# Altium schematic sheet mother_board.SchDoc
size A2
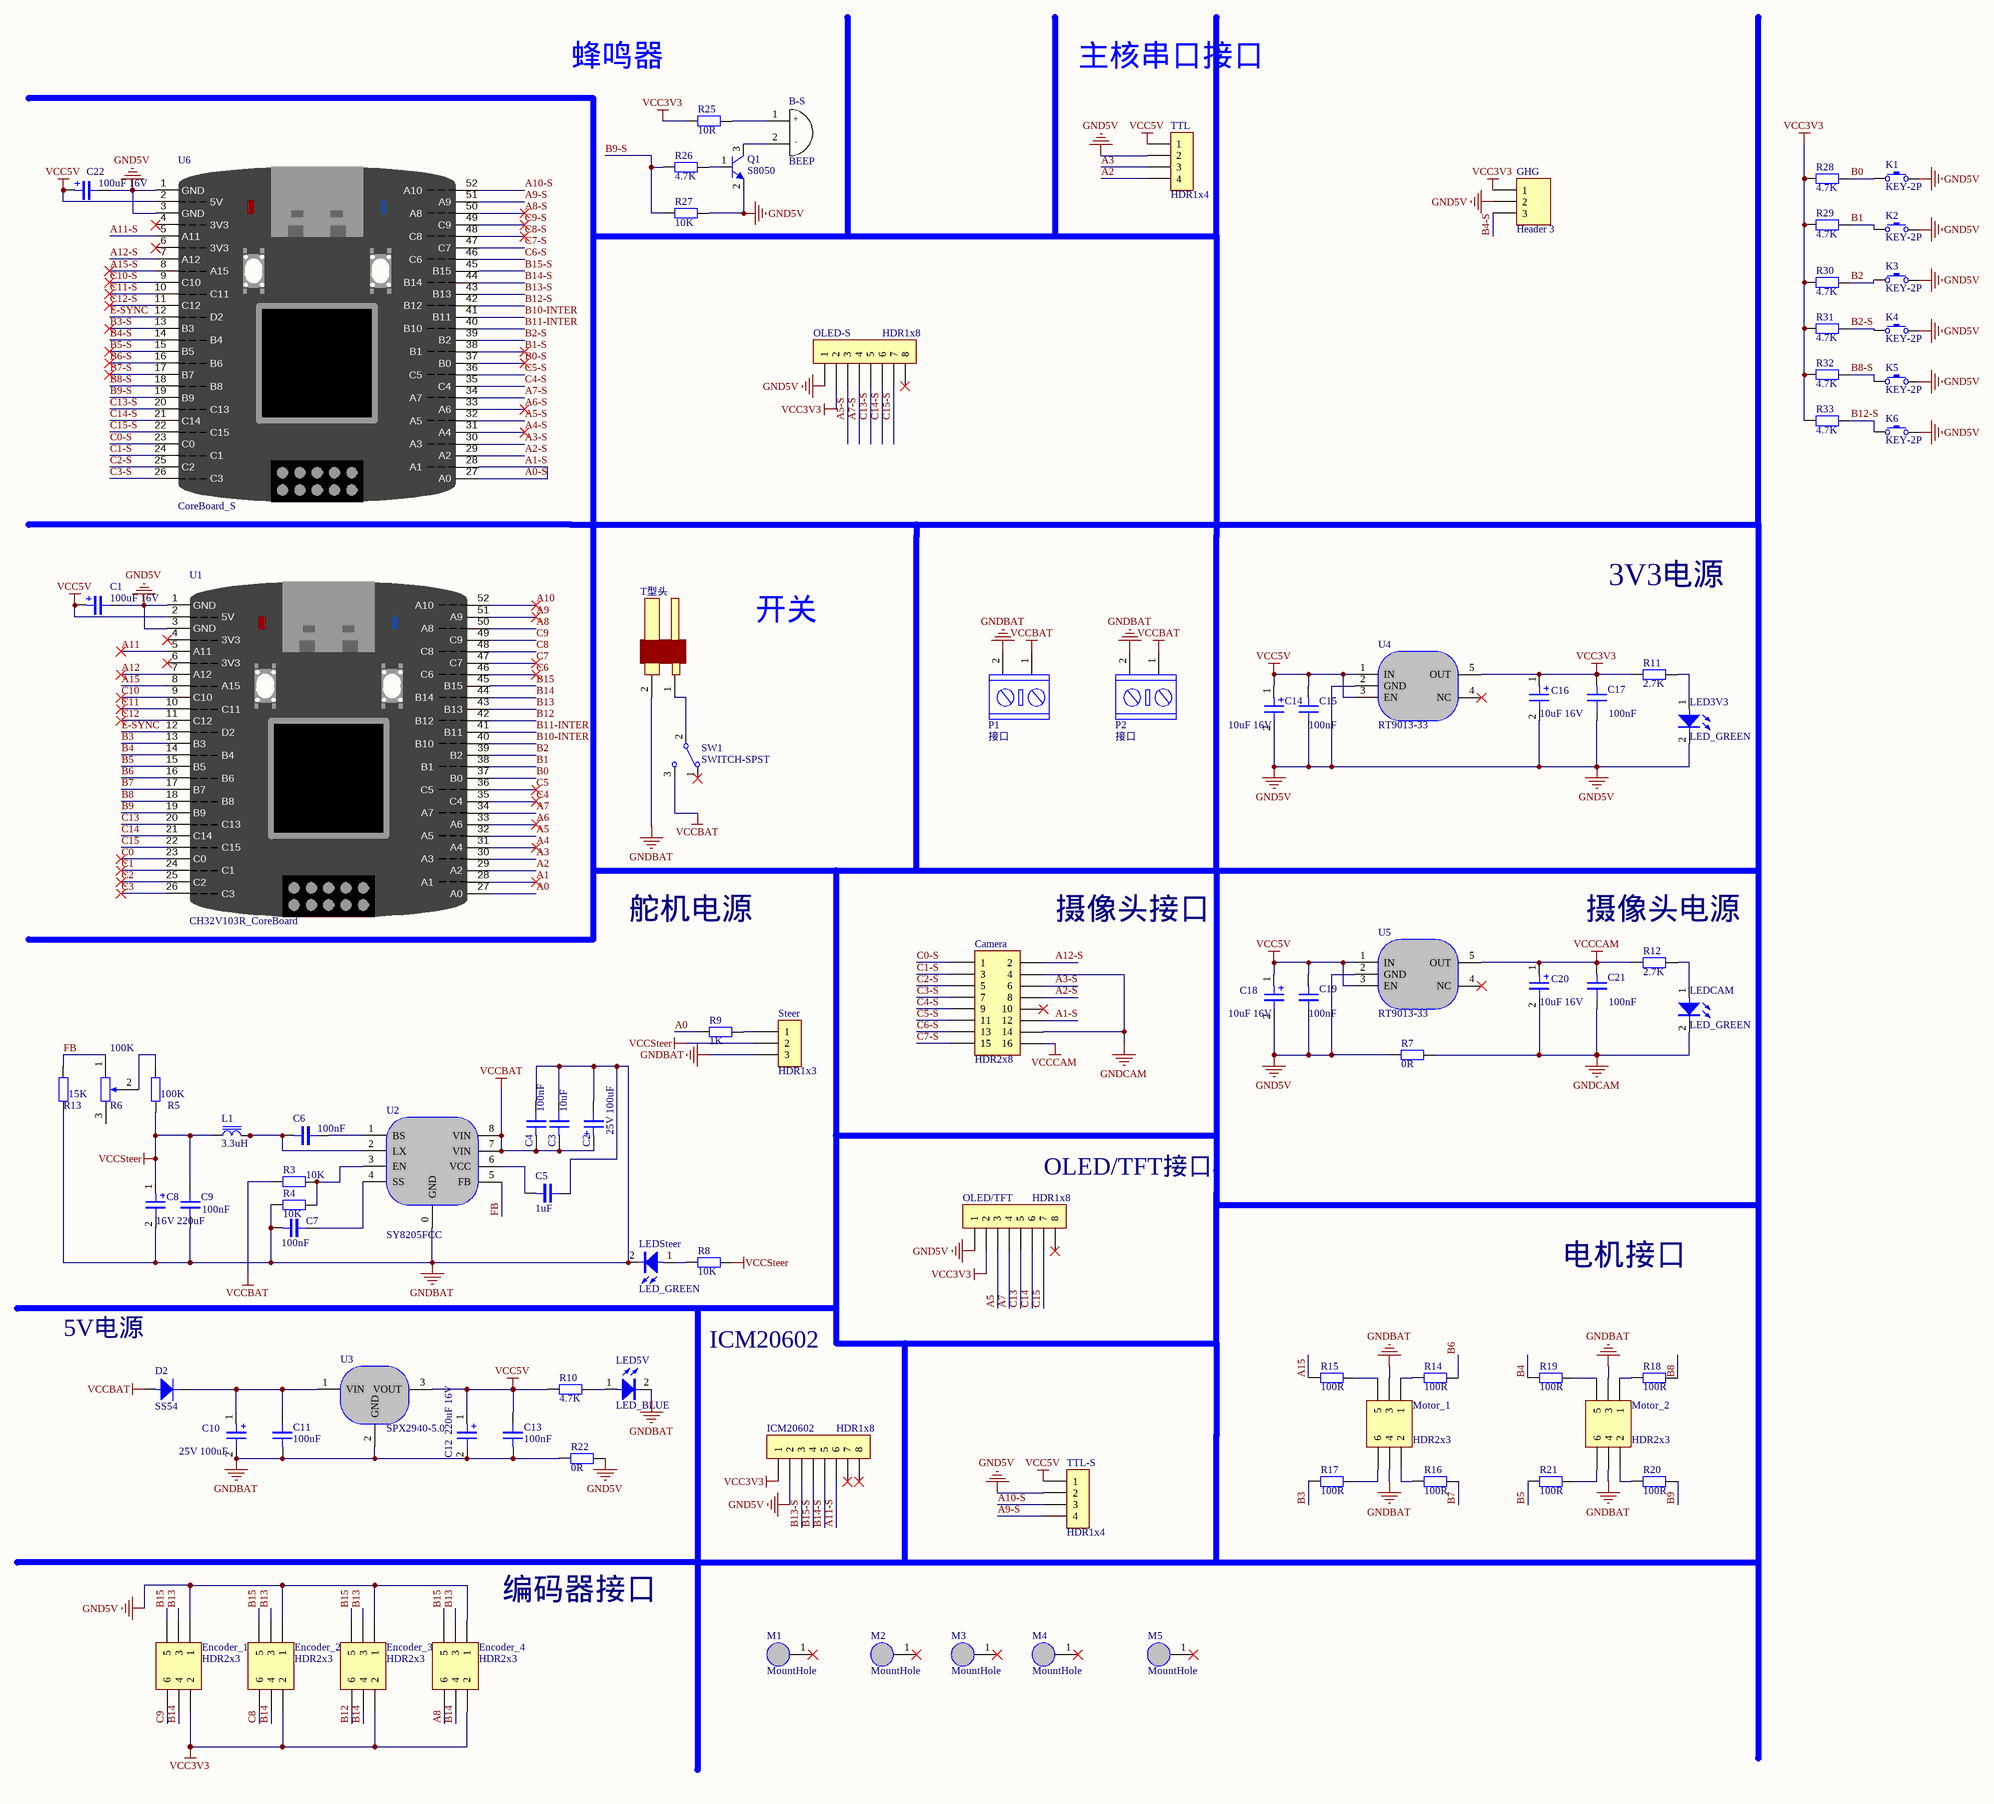
[diagram p0: mother_board.SchDoc]

## Parts
B-S  BEEP  [BUZ-TH_BD9.0-P4.00-D1.0-FD]
C1  100uF 16V  [CASE-D_7343]
C2  25V 100uF  [SMD-ECAP-6.3x5.3]
C3  10uF  [0603_R]
C4  100nF  [0603_R]
C5  1uF  [0603_R]
C6  100nF  [0603_R]
C7  100nF  [0603_R]
C8  16V 220uF  [SMD-ECAP-6.3x5.3]
C9  100nF  [0603_R]
C10  25V 100uF  [SMD-ECAP-6.3x5.3]
C11  100nF  [0603_R]
C12  220uF 16V  [SMD-ECAP-6.3x5.3]
C13  100nF  [0603_R]
C14  10uF 16V  [CASE-A_3216]
C15  100nF  [0603_R]
C16  10uF 16V  [CASE-A_3216]
C17  100nF  [0603_R]
C18  10uF 16V  [CASE-A_3216]
C19  100nF  [0603_R]
C20  10uF 16V  [CASE-A_3216]
C21  100nF  [0603_R]
C22  100uF 16V  [CASE-D_7343]
Camera  HDR2x8  [HDR2X8]
D2  SS54  [SMA(DO-214AC)_S1]
Encoder_1  HDR2x3  [HDR2X3]
Encoder_2  HDR2x3  [HDR2X3]
Encoder_3  HDR2x3  [HDR2X3]
Encoder_4  HDR2x3  [HDR2X3]
GHG  Header 3  [HDR1X3]
ICM20602  HDR1x8  [HDR1X8]
K1  KEY-2P  [SMD]
K2  KEY-2P  [SMD]
K3  KEY-2P  [SMD]
K4  KEY-2P  [SMD]
K5  KEY-2P  [SMD]
K6  KEY-2P  [SMD]
L1  3.3uH  [SMD-4.2x4.4x2.0]
LED3V3  LED_GREEN  [0603-LED]
LED5V  LED_BLUE  [0603-LED]
LEDCAM  LED_GREEN  [0603-LED]
LEDSteer  LED_GREEN  [0603-LED]
M1  MountHole  [MountHole]
M2  MountHole  [MountHole]
M3  MountHole  [MountHole]
M4  MountHole  [MountHole]
M5  MountHole  [HOLE]
Motor_1  HDR2x3  [HDR2X3]
Motor_2  HDR2x3  [HDR2X3]
OLED-S  HDR1x8  [HDR1X8]
OLED/TFT  HDR1x8  [HDR1X8]
P1  接口  [KF/WJ/DG 301-2p-5.0mm]
P2  接口  [KF/WJ/DG 301-2p-5.0mm]
Q1  S8050  [SOT-23(SOT-23-3)]
R3  10K  [0603_L]
R4  10K  [0603_L]
R5  100K  [0603_L]
R6  100K  [3296W]
R7  0R  [0603_L]
R8  10K  [0603_L]
R9  1K  [0603_L]
R10  4.7K  [0603_L]
R11  2.7K  [0603_L]
R12  2.7K  [0603_L]
R13  15K  [0603_L]
R14  100R  [0603_L]
R15  100R  [0603_L]
R16  100R  [0603_L]
R17  100R  [0603_L]
R18  100R  [0603_L]
R19  100R  [0603_L]
R20  100R  [0603_L]
R21  100R  [0603_L]
R22  0R  [0603_L]
R25  10R  [0603_L]
R26  4.7K  [0603_L]
R27  10K  [0603_L]
R28  4.7K  [0603_L]
R29  4.7K  [0603_L]
R30  4.7K  [0603_L]
R31  4.7K  [0603_L]
R32  4.7K  [0603_L]
R33  4.7K  [0603_L]
Steer  HDR1x3  [HDR1X3]
SW1  SWITCH-SPST  [ToggleSwitch 7102]
TTL  HDR1x4  [HDR1X4]
TTL-S  HDR1x4  [HDR1X4]
T型头  T型头  [T型头焊盘]  (value not drawn)
U1  CH32V103R_CoreBoard  [CH32V103R_CoreBoard]
U2  SY8205FCC  [SOIC-8_EP_150mil]
U3  SPX2940-5.0  [TO-263-3]
U4  RT9013-33  [SOT-23-5]
U5  RT9013-33  [SOT-23-5]
U6  CoreBoard_S  [CH32V103R_CoreBoard]

## Nets
GND5V: C1.2 C14.2 C15.2 C16.2 C17.2 C18.2 C19.2 C22.2 Encoder_1.1 Encoder_2.1 Encoder_3.1 Encoder_4.1 GHG.2 ICM20602.2 K1.2 K2.2 K3.2 K4.2 K5.2 K6.2 LED3V3.2(C) OLED-S.1 OLED/TFT.1 Q1.2(E) R7.1 R22.2 R27.2 TTL.2 TTL-S.2 U1.1(GND) U1.3(GND) U4.2(GND) U5.2(GND) U6.1(GND) U6.3(GND)
GNDBAT: C2.2 C3.2 C4.2 C5.2 C7.1 C8.2 C9.1 C10.2 C11.1 C12.2 C13.1 LED5V.2(C) LEDSteer.2(C) Motor_1.3 Motor_1.4 Motor_2.3 Motor_2.4 P1.2 P2.2 R4.1 R13.2 R22.1 Steer.3 T型头.2 U2.0(GND) U3.2(GND)
GNDCAM: C20.2 C21.2 Camera.4 Camera.14 LEDCAM.2(C) R7.2
VCC3V3: C16.1 C17.1 Encoder_1.2 Encoder_2.2 Encoder_3.2 Encoder_4.2 GHG.1 ICM20602.1 OLED-S.2 OLED/TFT.2 R11.1 R25.1 R28.1 R29.1 R30.1 R31.1 R32.1 R33.1 U4.5(OUT)
VCC5V: C1.1 C12.1 C13.2 C14.1 C15.1 C18.1 C19.1 C22.1 R10.1 TTL.1 TTL-S.1 U1.2(5V) U3.3(VOUT) U4.1(IN) U4.3(EN) U5.1(IN) U5.3(EN) U6.2(5V)
VCCBAT: C2.1 C3.1 C4.1 D2.1(A) P1.1 P2.1 R3.1 SW1.3 U2.7(VIN) U2.8(VIN)
VCCCAM: C20.1 C21.1 Camera.16 R12.1 U5.5(OUT)
VCCSteer: C8.1 C9.2 L1.1 R5.2 R8.2 Steer.2
A0: R9.1 U1.27(A0)
A0-S: Camera.12 U6.27(A0) U6.28(A1)  [also labelled A1-S]
A1: U1.28(A1)
A2: TTL.4 U1.29(A2)
A2-S: Camera.8 U6.29(A2)
A3: TTL.3 U1.30(A3)
A3-S: Camera.6 U6.30(A3)
A4: U1.31(A4)
A4-S: U6.31(A4)
A5: OLED/TFT.3 U1.32(A5)
A5-S: OLED-S.3 U6.32(A5)
A6: U1.33(A6)
A6-S: U6.33(A6)
A7: OLED/TFT.4 U1.34(A7)
A7-S: OLED-S.4 U6.34(A7)
A8: Encoder_4.6 U1.50(A8)
A8-S: U6.50(A8)
A9: U1.51(A9)
A9-S: TTL-S.4 U6.51(A9)
A10: U1.52(A10)
A10-S: TTL-S.3 U6.52(A10)
A11: U1.5(A11)
A11-S: ICM20602.6 U6.5(A11)
A12: U1.7(A12)
A12-S: Camera.2 U6.7(A12)
A15: R15.1 U1.8(A15)
A15-S: U6.8(A15)
B0: K1.1 R28.2 U1.37(B0)
B0-S: U6.37(B0)
B1: K2.1 R29.2 U1.38(B1)
B1-S: U6.38(B1)
B2: K3.1 R30.2 U1.39(B2)
B2-S: K4.1 R31.2 U6.39(B2)
B3: R17.1 U1.13(B3)
B3-S: U6.13(B3)
B4: R19.1 U1.14(B4)
B4-S: GHG.3 U6.14(B4)
B5: R21.1 U1.15(B5)
B5-S: U6.15(B5)
B6: R14.2 U1.16(B6)
B6-S: U6.16(B6)
B7: R16.2 U1.17(B7)
B7-S: U6.17(B7)
B8: R18.2 U1.18(B8)
B8-S: K5.1 R32.2 U6.18(B8)
B9: R20.2 U1.19(B9)
B9-S: R26.1 R27.1 U6.19(B9)
B10-INTER: U1.40(B10) U6.41(B11)
B11-INTER: U1.41(B11) U6.40(B10)
B12: Encoder_3.6 U1.42(B12)
B12-S: K6.1 R33.2 U6.42(B12)
B13: Encoder_1.3 Encoder_2.3 Encoder_3.3 Encoder_4.3 U1.43(B13)
B13-S: ICM20602.3 U6.43(B13)
B14: Encoder_1.4 Encoder_2.4 Encoder_3.4 Encoder_4.4 U1.44(B14)
B14-S: ICM20602.5 U6.44(B14)
B15: Encoder_1.5 Encoder_2.5 Encoder_3.5 Encoder_4.5 U1.45(B15)
B15-S: ICM20602.4 U6.45(B15)
C0: U1.23(C0)
C0-S: Camera.1 U6.23(C0)
C1: U1.24(C1)
C1-S: Camera.3 U6.24(C1)
C2: U1.25(C2)
C2-S: Camera.5 U6.25(C2)
C3: U1.26(C3)
C3-S: Camera.7 U6.26(C3)
C4: U1.35(C4)
C4-S: Camera.9 U6.35(C4)
C5: U1.36(C5)
C5-S: Camera.11 U6.36(C5)
C6: U1.46(C6)
C6-S: Camera.13 U6.46(C6)
C7: U1.47(C7)
C7-S: Camera.15 U6.47(C7)
C8: Encoder_2.6 U1.48(C8)
C8-S: U6.48(C8)
C9: Encoder_1.6 U1.49(C9)
C9-S: U6.49(C9)
C10: U1.9(C10)
C10-S: U6.9(C10)
C11: U1.10(C11)
C11-S: U6.10(C11)
C12: U1.11(C12)
C12-S: U6.11(C12)
C13: OLED/TFT.5 U1.20(C13)
C13-S: OLED-S.5 U6.20(C13)
C14: OLED/TFT.6 U1.21(C14)
C14-S: OLED-S.6 U6.21(C14)
C15: OLED/TFT.7 U1.22(C15)
C15-S: OLED-S.7 U6.22(C15)
E-SYNC: U1.12(D2) U6.12(D2)
FB: R6.1 R13.1 U2.5(FB)
NetB-S_1: B-S.1 R25.2
NetB-S_2: B-S.2 Q1.3(C)
NetC5_1: C5.1 U2.6(VCC)
NetC6_1: C6.1 L1.2 U2.2(LX)
NetC6_2: C6.2 U2.1(BS)
NetC7_2: C7.2 U2.4(SS)
NetC10_1: C10.1 C11.2 D2.2(C) U3.1(VIN)
NetLED3V3_1: LED3V3.1(A) R11.2
NetLED5V_1: LED5V.1(A) R10.2
NetLEDCAM_1: LEDCAM.1(A) R12.2
NetLEDSteer_1: LEDSteer.1(A) R8.1
NetMotor_1_1: Motor_1.1 R14.1
NetMotor_1_2: Motor_1.2 R16.1
NetMotor_1_5: Motor_1.5 R15.2
NetMotor_1_6: Motor_1.6 R17.2
NetMotor_2_1: Motor_2.1 R18.1
NetMotor_2_2: Motor_2.2 R20.1
NetMotor_2_5: Motor_2.5 R19.2
NetMotor_2_6: Motor_2.6 R21.2
NetQ1_1: Q1.1(B) R26.2
NetR3_2: R3.2 R4.2 U2.3(EN)
NetR5_1: R5.1 R6.2
NetR9_2: R9.2 Steer.1
NetSW1_2: SW1.2 T型头.1

Not connected (* = marked no-connect by the designer): Camera 10*; ICM20602 7* 8*; M1 1*; M2 1*; M3 1*; M4 1*; M5 1*; OLED-S 8*; OLED/TFT 8*; R6 3; SW1 1*; U1 4(3V3)* 6(3V3)*; U4 4(NC)*; U5 4(NC)*; U6 4(3V3)* 6(3V3)*

## Notes on the sheet
- 蜂鸣器
- 主核串口接口
- 3V3电源
- 开关
- 舵机电源
- 摄像头接口
- 摄像头电源
- OLED/TFT接口
- 电机接口
- 5V电源
- ICM20602
- 编码器接口
- Title
- Size:
- Date:
- File:
- A2
- Number:
- Time:
- Revision:
- Sheet
- of
- (in symbol BEEP) +; -

## Library data of the parts
C1 C2 C8 C10 C12 C14 C16 C18 C20 C22 = CAP-TANTALUM: Tantalum Capacitor
C3-C7 C9 C11 C13 C15 C17 C19 C21 = CAP: Capacitor
Camera = HDR2x8: Connector
D2 = SS54: Schottky Diode
Encoder_1-Encoder_4 Motor_1 Motor_2 = HDR2x3: Connector
GHG = Header 3: Header, 3-Pin; LatestRevisionDate: 17-Jul-2002; LatestRevisionNote: Re-released for DXP Platform.; Publisher: Altium Limited
ICM20602 OLED-S OLED/TFT = HDR1x8: Connector
K1-K6 = KEY-2P: Key
L1 = L?
LED3V3 LED5V LEDCAM LEDSteer = LED
Q1 = S8050: NPN Bipolar Transistor
R3-R5 R7-R22 R25-R33 = RES: Resistor
R6 = RES-CHANGABLE: 注意核对封装引脚
Steer = HDR1x3: Connector
SW1 = SWITCH-SPST: Switch
TTL TTL-S = HDR1x4: Connector
U1 U6 = CH32V103R_CoreBoard: 逐飞科技 CH32V103R核心板